# Altium schematic sheet CTR_Connectors.SchDoc: Connectors
size A4; DrawnBy: Andrei Divinagracia; Revision: 0A; SheetNumber: 2; SheetTotal: 10
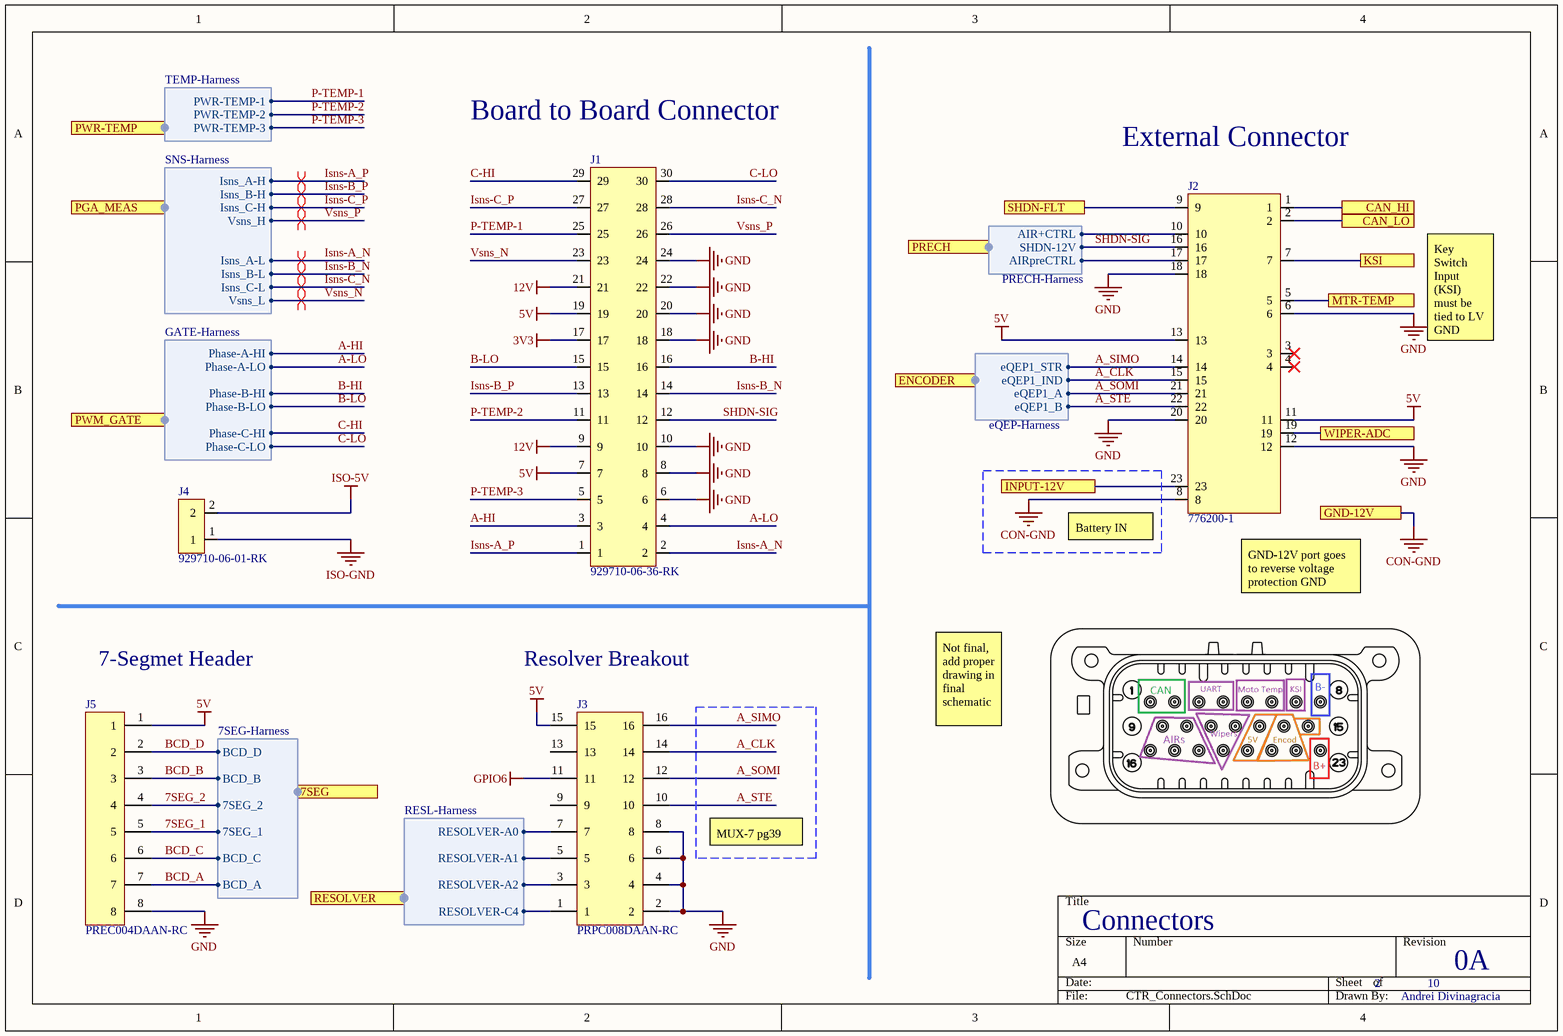
[diagram p0: CTR_Connectors.SchDoc]

## Parts
J1  929710-06-36-RK  [CONN_30POS_M]
J2  776200-1  [Conn 23POS]
J3  PRPC008DAAN-RC  [16PIN_HEADER]
J4  929710-06-01-RK  [CONN-2POS-LONG-M]
J5  PREC004DAAN-RC  [CONN-8PIN]

## Ports
7SEG (harness 7SEG-Harness), CAN_HI, CAN_LO, ENCODER (harness eQEP-Harness), GND-12V, INPUT-12V, KSI, MTR-TEMP, PGA_MEAS (harness SNS-Harness), PRECH (harness PRECH-Harness), PWM_GATE (harness GATE-Harness), PWR-TEMP (harness TEMP-Harness), RESOLVER (harness RESL-Harness), SHDN-FLT, WIPER-ADC

## Harnesses
SNS-Harness: Isns_A-H, Isns_B-H, Isns_C-H, Vsns_H, Isns_A-L, Isns_B-L, Isns_C-L, Vsns_L
TEMP-Harness: PWR-TEMP-1, PWR-TEMP-2, PWR-TEMP-3
GATE-Harness: Phase-A-HI, Phase-A-LO, Phase-B-HI, Phase-B-LO, Phase-C-LO, Phase-C-HI
RESL-Harness: RESOLVER-A0, RESOLVER-A1, RESOLVER-A2, RESOLVER-C4
7SEG-Harness: 7SEG_2, 7SEG_1, BCD_C, BCD_B, BCD_A, BCD_D
PRECH-Harness: AIRpreCTRL, AIR+CTRL, SHDN-12V
eQEP-Harness: eQEP1_A, eQEP1_B, eQEP1_IND, eQEP1_STR

## Nets
3V3: J1.17
5V: J1.7 J1.19 J2.11 J2.13 J3.15 J5.1
12V: J1.9 J1.21
CON-GND: J2.8 ; port GND-12V
GND: J1.6 J1.8 J1.10 J1.18 J1.20 J1.22 J1.24 J2.6 J2.12 J2.18 J2.20 J3.2 J3.4 J3.6 J3.8 J5.8
GPIO6: J3.11
ISO-5V: J4.2
ISO-GND: J4.1
7SEG_1: J5.5 ; port 7SEG.7SEG_1
7SEG_2: J5.4 ; port 7SEG.7SEG_2
A-HI: J1.3 ; port PWM_GATE.Phase-A-HI
A-LO: J1.4 ; port PWM_GATE.Phase-A-LO
A_CLK: J2.15 J3.14 ; port ENCODER.eQEP1_IND
A_SIMO: J2.14 J3.16 ; port ENCODER.eQEP1_STR
A_SOMI: J2.21 J3.12 ; port ENCODER.eQEP1_A
A_STE: J2.22 J3.10 ; port ENCODER.eQEP1_B
B-HI: J1.16 ; port PWM_GATE.Phase-B-HI
B-LO: J1.15 ; port PWM_GATE.Phase-B-LO
BCD_A: J5.7 ; port 7SEG.BCD_A
BCD_B: J5.3 ; port 7SEG.BCD_B
BCD_C: J5.6 ; port 7SEG.BCD_C
BCD_D: J5.2 ; port 7SEG.BCD_D
C-HI: J1.29 ; port PWM_GATE.Phase-C-HI
C-LO: J1.30 ; port PWM_GATE.Phase-C-LO
CAN_HI: J2.1 ; port CAN_HI
CAN_LO: J2.2 ; port CAN_LO
INPUT-12V: J2.23 ; port INPUT-12V
Isns-A_N: J1.2 ; port PGA_MEAS.Isns_A-L
Isns-A_P: J1.1 ; port PGA_MEAS.Isns_A-H
Isns-B_N: J1.14 ; port PGA_MEAS.Isns_B-L
Isns-B_P: J1.13 ; port PGA_MEAS.Isns_B-H
Isns-C_N: J1.28 ; port PGA_MEAS.Isns_C-L
Isns-C_P: J1.27 ; port PGA_MEAS.Isns_C-H
KSI: J2.7 ; port KSI
MTR-TEMP: J2.5 ; port MTR-TEMP
P-TEMP-1: J1.25 ; port PWR-TEMP.PWR-TEMP-1
P-TEMP-2: J1.11 ; port PWR-TEMP.PWR-TEMP-2
P-TEMP-3: J1.5 ; port PWR-TEMP.PWR-TEMP-3
SHDN-FLT: J2.9 ; port SHDN-FLT
SHDN-SIG: J1.12 J2.16 ; port PRECH.SHDN-12V
Vsns_N: J1.23 ; port PGA_MEAS.Vsns_L
Vsns_P: J1.26 ; port PGA_MEAS.Vsns_H
WIPER-ADC: J2.19 ; port WIPER-ADC
NetJ2_10: J2.10 ; port PRECH.AIR+CTRL
NetJ2_17: J2.17 ; port PRECH.AIRpreCTRL
NetJ3_1: J3.1 ; port RESOLVER.RESOLVER-C4
NetJ3_3: J3.3 ; port RESOLVER.RESOLVER-A2
NetJ3_5: J3.5 ; port RESOLVER.RESOLVER-A1
NetJ3_7: J3.7 ; port RESOLVER.RESOLVER-A0

Not connected (* = marked no-connect by the designer): J2 3* 4*; J3 9 13

## Layout directives
differential pair: Isns-A_N, Isns-A_P, Isns-B_N, Isns-B_P, Isns-C_N, Isns-C_P, Vsns_N, Vsns_P

## Notes on the sheet
- (near J1) Board to Board Connector
- (near J2) External Connector
- Key Switch Input (KSI) must be tied to LV GND
- (near J2) Battery IN
- (near J2) GND-12V port goes to reverse voltage protection GND
- (near J5) 7-Segmet Header
- (near J3) Resolver Breakout
- Not final, add proper drawing in final schematic
- MUX-7 pg39

## Library data of the parts
J1 = CONN-72POS-M: CONN HEADER VERT 72POS 2.54MM; Manufacturer: 3M; Number of Positions: 72; Gender: Male; Connector Type: Male Pin; Max Current Rating: 2.5A; Pitch: 0.1inch; Supplier 1: Digi-Key; Manufacturer Part Number: 929710-06-36-RK; Stock 1: 312; Pricing 1: 1=6.62, 10=6.342, 100=5.2389, 500=4.41168, 1000=3.86022 (USD); Mount: Through Hole; Color: Black; Contact Plating: Tin; Housing Color: Black; Contact Material: Copper Alloy; Housing Material: Polychlorinated; Min Operating Temperature: -40°C; Max Operating Temperature: 105°C; Package Quantity: 100; Number of Rows: 2; Packaging: Bulk; Termination: Solder; Series: 929; Contact Type: Male Pin; Orientation: Straight; Length: 91.4mm; Width: 5.46mm; Height: 2.54mm; Row Spacing: 0.1inch; Contact Mating Length: 0.318inch; Depth: 5.48mm; Lead Free: Lead Free; RoHS Compliant: Yes; ComponentLink1URL: http://www.mouser.com/ds/2/1/ts0769-35914.pdf?src-supplier=Mouser; ComponentLink1Description: http://www.mouser.com/ds/2/1/ts0769-35914.pdf?src-supplier=Mouser; ComponentLink2URL: http://multimedia.3m.com/mws/mediawebserver?66666UuZjcFSLXTtmXME5x46EVuQEcuZgVs6EVs6E666666--?src-supplier=Digi-Key; ComponentLink2Description: http://multimedia.3m.com/mws/mediawebserver?66666UuZjcFSLXTtmXME5x46EVuQEcuZgVs6EVs6E666666--?src-supplier=Digi-Key; Supplier Part Number 1: 3M156366-72-ND
J2 = CONN-23POS: CONN HEADER VERT 23POS 4MM; Manufacturer: TE Connectivity AMP; Number of Positions: 23; Gender: Male; Circuit Application: Power; PCB Mount Alignment: Yes (With); PCB Mount Retention: Without; Shielding: Unshielded; Max Voltage Rating (AC): 250V; Connector System: Wire-to-Device; Pitch: 0.157inch; PCB Thickness: 0.062inch; Tab Thickness: 1.3mm; Supplier 1: Digi-Key; Manufacturer Part Number: 776200-1; Stock 1: 0; Pricing 1: 1=11.1, 10=10.621, 100=8.9314, 500=7.48308, 1000=6.61409 (USD); Mount: Panel,Through Hole; Contact Plating: Tin; Contact Material: Brass; Housing Material: Thermoplastic; Color: Black; Min Operating Temperature: -40°C; Max Operating Temperature: 221°C; Number of Rows: 3; Packaging: Bulk; Package Quantity: 1; Termination: Solder; Series: Ampseal Sealed; Number of Contacts: 23; Orientation: Straight; Number of Signal Positions: 23; Sealable: Yes (With); Length: 60.8mm; Width: 1.264inch; Height: 32.1mm; Depth: 32.1mm; Radiation Hardening: No; ELV: Compliant; Flammability Rating: UL94 V-0; Lead Free: Lead Free; ComponentLink1URL: http://uk.rs-online.com/webdocs/1013/0900766b81013e1b.pdf?src-supplier=RSComponents; ComponentLink1Description: http://uk.rs-online.com/webdocs/1013/0900766b81013e1b.pdf?src-supplier=RSComponents; ComponentLink2URL: http://www.te.com/commerce/DocumentDelivery/DDEController?Action=srchrtrv&DocNm=1654285_AMPSEAL_Sealed_Connector&DocType=CS&DocLang=English&s_cid=1046&src-supplier=Avnet; ComponentLink2Description: http://www.te.com/commerce/DocumentDelivery/DDEController?Action=srchrtrv&DocNm=1654285_AMPSEAL_Sealed_Connector&DocType=CS&DocLang=English&s_cid=1046&src-supplier=Avnet; ComponentLink3URL: http://www1.futureelectronics.com/doc/TYCO%20ELECTRONICS/776200-1.pdf?src-supplier=Future+Electronics; ComponentLink3Description: http://www1.futureelectronics.com/doc/TYCO%20ELECTRONICS/776200-1.pdf?src-supplier=Future+Electronics; Supplier Part Number 1: A129020-ND
J3 = PRPC008DAAN-RC: CONN HEADER VERT 16POS 2.54MM; Manufacturer: Sullins; Number of Positions: 16; Connector Type: Male Pin; Pitch: 0.1inch; Supplier 1: Digi-Key; Manufacturer Part Number: PRPC008DAAN-RC; Stock 1: 10217; Pricing 1: 1=0.46, 10=0.433, 25=0.3716, 50=0.3158, 100=0.3034, 250=0.27244, 500=0.26006 (USD); Mount: Through Hole; Color: Black; Contact Plating: Gold; Package Quantity: 1; Number of Rows: 2; Packaging: Bulk; Termination: Solder; Series: -; Contact Type: Male Pin; Row Spacing: 0.1inch; Contact Mating Length: 0.23inch; RoHS Compliant: Yes; ComponentLink1URL: https://drawings-pdf.s3.amazonaws.com/11636.pdf?src-supplier=Digi-Key; ComponentLink1Description: https://drawings-pdf.s3.amazonaws.com/11636.pdf?src-supplier=Digi-Key; Supplier Part Number 1: S2011EC-08-ND
J4 = CONN-2POS-LONG-M: CONN HEADER VERT 2POS; Manufacturer: 3M; Number of Positions: 2; Gender: Male; Connector Type: Male Pin; Max Current Rating: 2.5A; Row Spacing: 0.1inch; Supplier 1: Digi-Key; Manufacturer Part Number: 929710-06-01-RK; Stock 1: 0; Pricing 1: 1=0.32, 10=0.303, 25=0.26, 50=0.221, 100=0.2123, 250=0.19068, 500=0.182 (USD); Mount: Through Hole; Color: Black; Contact Plating: Tin; Contact Material: Copper Alloy; Housing Material: Polychlorinated; Housing Color: Black; Min Operating Temperature: -40°C; Max Operating Temperature: 105°C; Package Quantity: 1000; Number of Rows: 2; Packaging: Bulk; Termination: Solder; Series: 929; Contact Type: Male Pin; Orientation: Straight; Length: 2.5mm; Contact Mating Length: 0.318inch; Depth: 5.46mm; RoHS Compliant: Yes; ComponentLink1URL: http://multimedia.3m.com/mws/mediawebserver?66666UuZjcFSLXTtmXME5x46EVuQEcuZgVs6EVs6E666666--?src-supplier=Digi-Key; ComponentLink1Description: http://multimedia.3m.com/mws/mediawebserver?66666UuZjcFSLXTtmXME5x46EVuQEcuZgVs6EVs6E666666--?src-supplier=Digi-Key; Supplier Part Number 1: 3M156366-02-ND
J5 = CONN-8PIN: CONN HEADER VERT 8POS 2.54MM; Manufacturer: Sullins; Number of Positions: 8; Connector Type: Male Pin; Pitch: 0.1inch; Supplier 1: Digi-Key; Manufacturer Part Number: PREC004DAAN-RC; Stock 1: 939; Pricing 1: 1=0.19, 10=0.179, 25=0.1524, 50=0.1334, 100=0.1239, 250=0.10956, 500=0.1048 (USD); Mount: Through Hole; Color: Black; Contact Plating: Tin; Package Quantity: 1; Number of Rows: 2; Packaging: Bulk; Termination: Solder; Series: -; Contact Type: Male Pin; Row Spacing: 0.1inch; Contact Mating Length: 0.23inch; RoHS Compliant: Yes; ComponentLink1URL: https://drawings-pdf.s3.amazonaws.com/11636.pdf?src-supplier=Digi-Key; ComponentLink1Description: https://drawings-pdf.s3.amazonaws.com/11636.pdf?src-supplier=Digi-Key; Supplier Part Number 1: S2012EC-04-ND